# EAGLE design integrated_haptic (EAGLE 6.5.0)

## Sheet 1 of 6
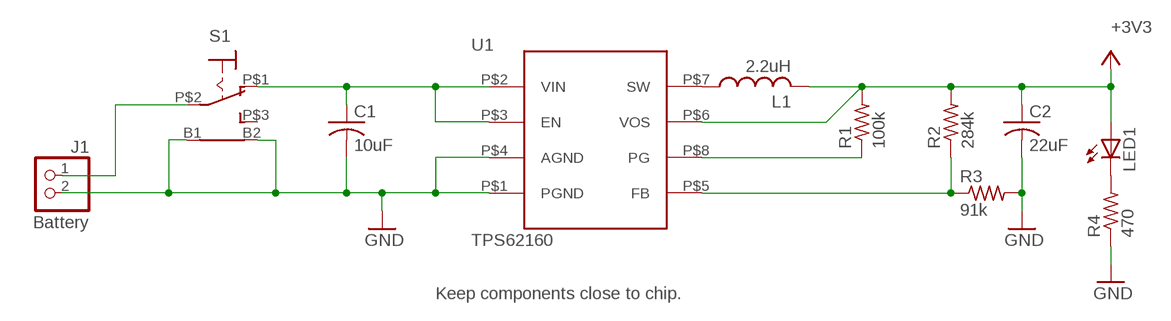
[diagram p0: schematic, sheet 1]

### Parts
C1  10uF  C-USC1206K  [C1206K]
C2  22uF  C-USC1206K  [C1206K]
J1  Battery  PINHD-1X2  [1X02]
L1  2.2uH  L-USL2520P  [L2520P]
LED1  LEDCHIP-LED0805  [CHIP-LED0805]
R1  100k  R-US_R0603  [R0603]
R2  284k  R-US_R0603  [R0603]
R3  91k  R-US_R0603  [R0603]
R4  470  R-US_R0603  [R0603]
S1  7101MD9AQE  [7101MD9A]
U1  TPS62160  [VSSOP]

### Nets
+3V3: C2.1 L1.2 LED1.A R1.2 R2.2 U1.P$6(VOS) ; also sheet 2,3,4,5
GND: C1.2 C2.2 J1.2 R3.2 R4.1 S1.B1(B) S1.B2(B1) U1.P$1(PGND) U1.P$4(AGND) ; also sheet 2,3,4,5,6
N$3: L1.1 U1.P$7(SW)
N$5: J1.1 S1.P$2(P)
N$17: LED1.C R4.2
N$32: R2.1 R3.1 U1.P$5(FB)
POWER_PG: R1.1 U1.P$8(PG)
VBAT: C1.1 S1.P$1(O) U1.P$2(VIN) U1.P$3(EN)
Unconnected: S1.P$3(S)

### Notes on the sheet
- Keep components close to chip.

## Sheet 2 of 6
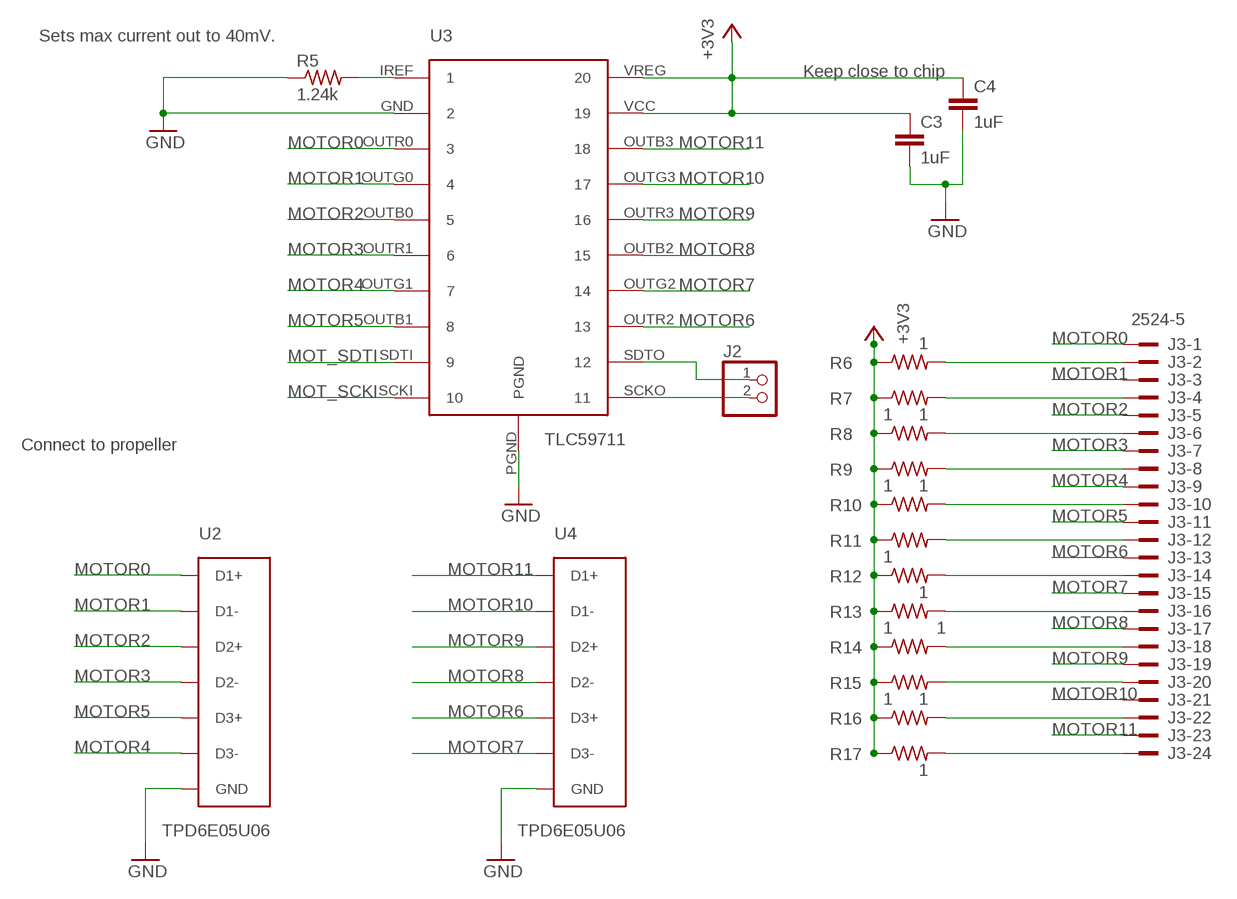
[diagram p1: schematic, sheet 2]

### Parts
C3  1uF  C-EUC0805K  [C0805K]
C4  1uF  C-EUC0805K  [C0805K]
J2  PINHD-1X2  [1X02]
J3  2524-5  [PAK100/2500-5-24]
R5  1.24k  R-US_R0603  [R0603]
R6  1  R-US_R0805  [R0805]
R7  1  R-US_R0805  [R0805]
R8  1  R-US_R0805  [R0805]
R9  1  R-US_R0805  [R0805]
R10  1  R-US_R0805  [R0805]
R11  1  R-US_R0805  [R0805]
R12  1  R-US_R0805  [R0805]
R13  1  R-US_R0805  [R0805]
R14  1  R-US_R0805  [R0805]
R15  1  R-US_R0805  [R0805]
R16  1  R-US_R0805  [R0805]
R17  1  R-US_R0805  [R0805]
U2  TPD6E05U06  [PUQFN-N14]
U3  TLC59711  [TLC59711]
U4  TPD6E05U06  [PUQFN-N14]

### Nets
+3V3: C3.1 C4.1 R6.1 R7.1 R8.1 R9.1 R10.1 R11.1 R12.1 R13.1 R14.1 R15.1 R16.1 R17.1 U3.VCC U3.VREG ; also sheet 1,3,4,5
GND: C3.2 C4.2 R5.1 U2.P$5(GND) U2.P$10(GND) U3.GND U3.PGND U4.P$5(GND) U4.P$10(GND) ; also sheet 1,3,4,5,6
MOT_SCKI: U3.SCKI ; also sheet 4,5
MOT_SDTI: U3.SDTI ; also sheet 4,5
MOTOR0: J3.1 U2.P$1(D1+) U2.P$14(D1+) U3.OUTR0
MOTOR1: J3.3 U2.P$2(D1-) U2.P$13(D1-) U3.OUTG0
MOTOR2: J3.5 U2.P$3(D2+) U2.P$12(D2+) U3.OUTB0
MOTOR3: J3.7 U2.P$4(D2-) U2.P$11(D2-) U3.OUTR1
MOTOR4: J3.9 U2.P$6(D3-) U2.P$9(D3-) U3.OUTG1
MOTOR5: J3.11 U2.P$7(D3+) U2.P$8(D3+) U3.OUTB1
MOTOR6: J3.13 U3.OUTR2 U4.P$7(D3+) U4.P$8(D3+)
MOTOR7: J3.15 U3.OUTG2 U4.P$6(D3-) U4.P$9(D3-)
MOTOR8: J3.17 U3.OUTB2 U4.P$4(D2-) U4.P$11(D2-)
MOTOR9: J3.19 U3.OUTR3 U4.P$3(D2+) U4.P$12(D2+)
MOTOR10: J3.21 U3.OUTG3 U4.P$2(D1-) U4.P$13(D1-)
MOTOR11: J3.23 U3.OUTB3 U4.P$1(D1+) U4.P$14(D1+)
N$1: R5.2 U3.IREF
N$4: J3.24 R17.2
N$6: J3.22 R16.2
N$7: J3.20 R15.2
N$8: J3.18 R14.2
N$9: J3.16 R13.2
N$10: J3.14 R12.2
N$11: J3.12 R11.2
N$12: J3.10 R10.2
N$13: J3.8 R9.2
N$14: J3.6 R8.2
N$15: J3.4 R7.2
N$16: J3.2 R6.2
N$18: J2.2 U3.SCKO
N$19: J2.1 U3.SDTO

### Notes on the sheet
- Sets max current out to 40mV.
- Keep close to chip
- Connect to propeller

## Sheet 3 of 6
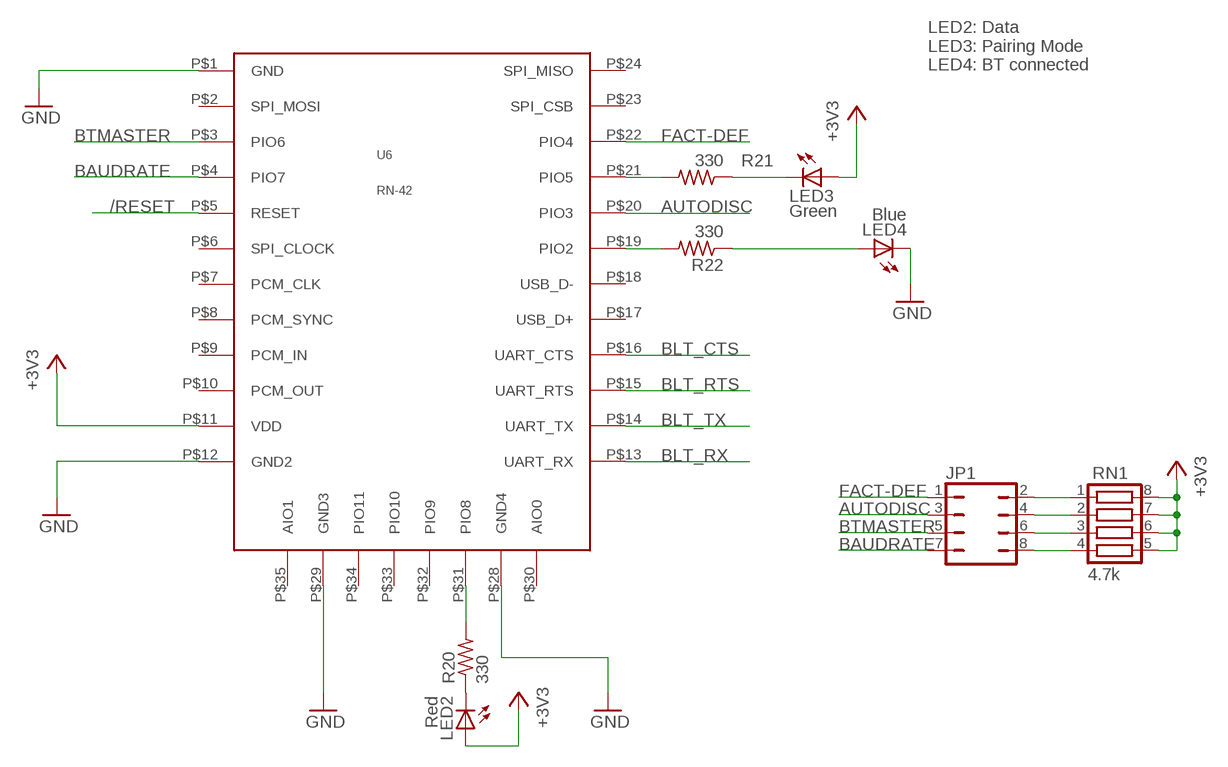
[diagram p2: schematic, sheet 3]

### Parts
JP1  JP4Q  [JP4Q]
LED2  Red  LEDCHIP-LED0805  [CHIP-LED0805]
LED3  Green  LEDCHIP-LED0805  [CHIP-LED0805]
LED4  Blue  LEDCHIP-LED0805  [CHIP-LED0805]
R20  330  R-US_R0603  [R0603]
R21  330  R-US_R0603  [R0603]
R22  330  R-US_R0603  [R0603]
RN1  4.7k  CTS742C083  [CTS742C083]
U6  RN-42  [RN-42]

### Nets
+3V3: LED2.A LED3.A RN1.5 RN1.6 RN1.7 RN1.8 U6.P$11(VDD) ; also sheet 1,2,4,5
/RESET: U6.P$5(RESET) ; also sheet 5,6
AUTODISC: JP1.3 U6.P$20(PIO3)
BAUDRATE: JP1.7 U6.P$4(PIO7)
BLT_CTS: U6.P$16(UART_CTS) ; also sheet 5
BLT_RTS: U6.P$15(UART_RTS) ; also sheet 5
BLT_RX: U6.P$13(UART_RX) ; also sheet 4,5
BLT_TX: U6.P$14(UART_TX) ; also sheet 4,5
BTMASTER: JP1.5 U6.P$3(PIO6)
FACT-DEF: JP1.1 U6.P$22(PIO4)
GND: LED4.C U6.P$1(GND) U6.P$12(GND2) U6.P$28(GND4) U6.P$29(GND3) ; also sheet 1,2,4,5,6
N$2: LED2.C R20.1
N$21: R21.2 U6.P$21(PIO5)
N$22: LED3.C R21.1
N$23: R22.2 U6.P$19(PIO2)
N$24: LED4.A R22.1
N$25: R20.2 U6.P$31(PIO8)
N$26: JP1.8 RN1.4
N$27: JP1.6 RN1.3
N$28: JP1.4 RN1.2
N$29: JP1.2 RN1.1
Unconnected: U6.P$2(SPI_MOSI) U6.P$6(SPI_CLOCK) U6.P$7(PCM_CLK) U6.P$8(PCM_SYNC) U6.P$9(PCM_IN) U6.P$10(PCM_OUT) U6.P$17(USB_D+) U6.P$18(USB_D-) U6.P$23(SPI_CSB) U6.P$24(SPI_MISO) U6.P$30(AIO0) U6.P$32(PIO9) U6.P$33(PIO10) U6.P$34(PIO11) U6.P$35(AIO1)

### Notes on the sheet
- LED2: Data
  LED3: Pairing Mode
  LED4: BT connected

## Sheet 4 of 6
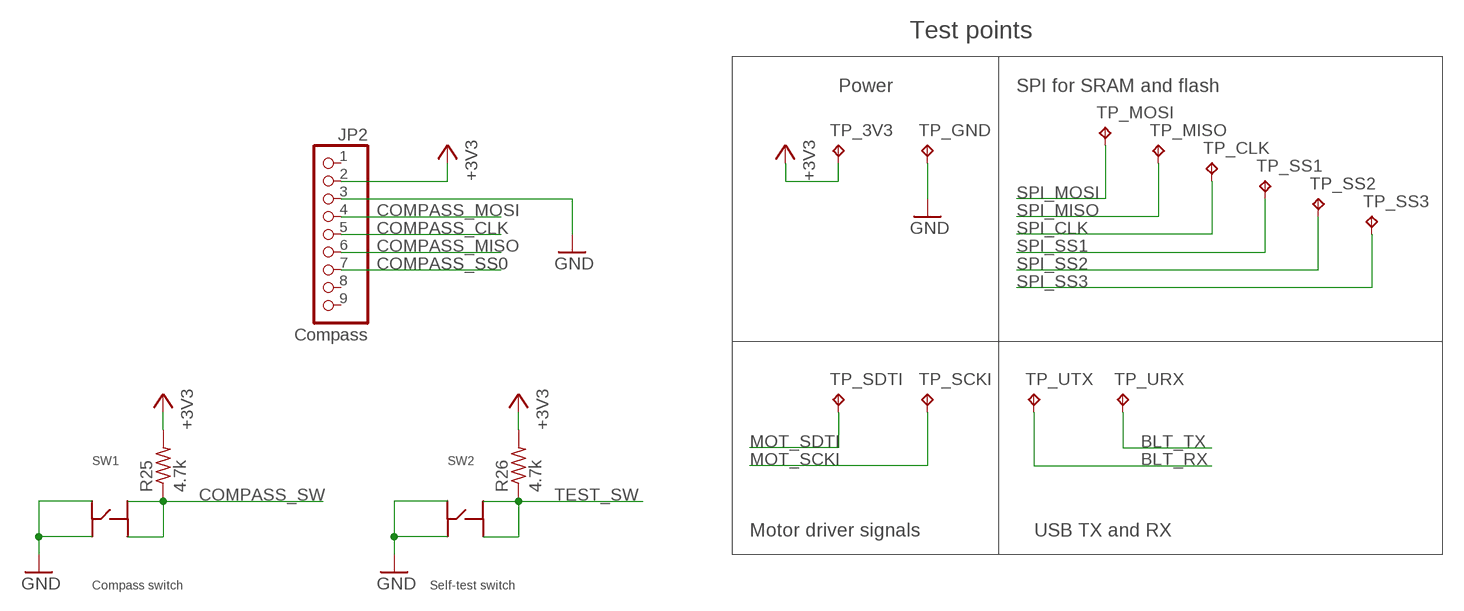
[diagram p3: schematic, sheet 4]

### Parts
JP2  Compass  PINHD-1X9  [1X09]
R25  4.7k  R-US_R0603  [R0603]
R26  4.7k  R-US_R0603  [R0603]
SW1  Compass switch  PUSHBUTTON  [6MMX6MM]
SW2  Self-test switch  PUSHBUTTON  [6MMX6MM]
TP_3V3  TPPAD1-13  [P1-13]
TP_CLK  TPPAD1-13  [P1-13]
TP_GND  TPPAD1-13  [P1-13]
TP_MISO  TPPAD1-13  [P1-13]
TP_MOSI  SPI_MOSI  TPPAD1-13  [P1-13]
TP_SCKI  TPPAD1-13  [P1-13]
TP_SDTI  TPPAD1-13  [P1-13]
TP_SS1  TPPAD1-13  [P1-13]
TP_SS2  TPPAD1-13  [P1-13]
TP_SS3  TPPAD1-13  [P1-13]
TP_URX  TPPAD1-13  [P1-13]
TP_UTX  TPPAD1-13  [P1-13]

### Nets
+3V3: JP2.2 R25.2 R26.2 TP_3V3.TP ; also sheet 1,2,3,5
BLT_RX: TP_UTX.TP ; also sheet 3,5
BLT_TX: TP_URX.TP ; also sheet 3,5
COMPASS_CLK: JP2.5 ; also sheet 5
COMPASS_MISO: JP2.6 ; also sheet 5
COMPASS_MOSI: JP2.4 ; also sheet 5
COMPASS_SS0: JP2.7 ; also sheet 5
COMPASS_SW: R25.1 SW1.P$2 SW1.P$4 ; also sheet 5
GND: JP2.3 SW1.P$1 SW1.P$3 SW2.P$1 SW2.P$3 TP_GND.TP ; also sheet 1,2,3,5,6
MOT_SCKI: TP_SCKI.TP ; also sheet 2,5
MOT_SDTI: TP_SDTI.TP ; also sheet 2,5
SPI_CLK: TP_CLK.TP ; also sheet 5
SPI_MISO: TP_MISO.TP ; also sheet 5
SPI_MOSI: TP_MOSI.TP ; also sheet 5
SPI_SS1: TP_SS1.TP ; also sheet 5
SPI_SS2: TP_SS2.TP ; also sheet 5
SPI_SS3: TP_SS3.TP ; also sheet 5
TEST_SW: R26.1 SW2.P$2 SW2.P$4 ; also sheet 5
Unconnected: JP2.1 JP2.8 JP2.9

### Notes on the sheet
- Test points
- Power | SPI for SRAM and flash
- Motor driver signals | USB TX and RX

## Sheet 5 of 6
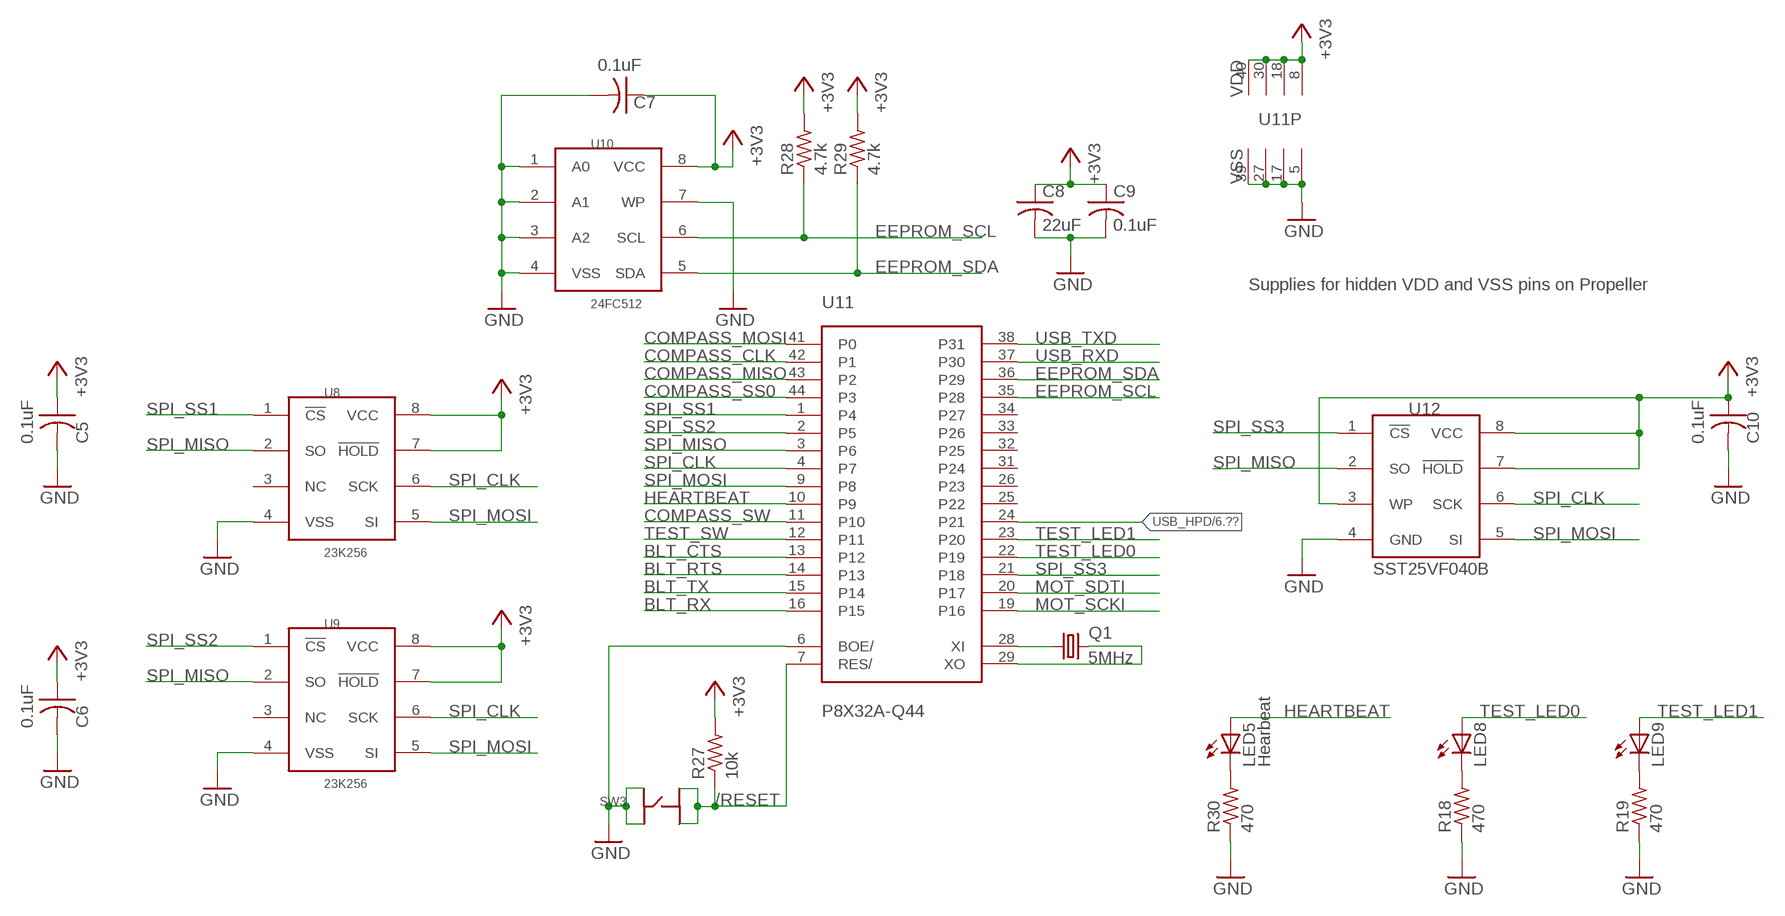
[diagram p4: schematic, sheet 5]

### Parts
C5  0.1uF  C-USC0805K  [C0805K]
C6  0.1uF  C-USC0805K  [C0805K]
C7  0.1uF  C-USC0805K  [C0805K]
C8  22uF  C-USC1206K  [C1206K]
C9  0.1uF  C-USC0805K  [C0805K]
C10  0.1uF  C-USC0805K  [C0805K]
LED5  Hearbeat  LEDCHIP-LED0805  [CHIP-LED0805]
LED8  LEDCHIP-LED0805  [CHIP-LED0805]
LED9  LEDCHIP-LED0805  [CHIP-LED0805]
Q1  5MHz  CRYSTALHC49UP  [HC49UP]
R18  470  R-US_R0603  [R0603]
R19  470  R-US_R0603  [R0603]
R27  10k  R-US_R0603  [R0603]
R28  4.7k  R-US_R0603  [R0603]
R29  4.7k  R-US_R0603  [R0603]
R30  470  R-US_R0603  [R0603]
SW3  PUSHBUTTON  [6MMX6MM]
U8  23K256  [SOIC8]
U9  23K256  [SOIC8]
U10  24FC512  [SOIC8]
U11  P8X32A-Q44  [P8X32A-Q44]
U12  SST25VF040B  [SOIC8]

### Nets
+3V3: C5.1 C6.1 C7.1 C8.1 C9.1 C10.1 R27.2 R28.2 R29.2 U8.7(!HOLD) U8.8(VCC) U9.7(!HOLD) U9.8(VCC) U10.8(VCC) U11.8(VDD) U11.18(VDD) U11.30(VDD) U11.40(VDD) U12.3(WP) U12.7(!HOLD) U12.8(VCC) ; also sheet 1,2,3,4
/RESET: R27.1 SW3.P$2 SW3.P$4 U11.7(RES/) ; also sheet 3,6
BLT_CTS: U11.13(P12) ; also sheet 3
BLT_RTS: U11.14(P13) ; also sheet 3
BLT_RX: U11.16(P15) ; also sheet 3,4
BLT_TX: U11.15(P14) ; also sheet 3,4
COMPASS_CLK: U11.42(P1) ; also sheet 4
COMPASS_MISO: U11.43(P2) ; also sheet 4
COMPASS_MOSI: U11.41(P0) ; also sheet 4
COMPASS_SS0: U11.44(P3) ; also sheet 4
COMPASS_SW: U11.11(P10) ; also sheet 4
EEPROM_SCL: R28.1 U10.6(SCL) U11.35(P28)
EEPROM_SDA: R29.1 U10.5(SDA) U11.36(P29)
GND: C5.2 C6.2 C7.2 C8.2 C9.2 C10.2 R18.1 R19.1 R30.1 SW3.P$1 SW3.P$3 U8.4(VSS) U9.4(VSS) U10.1(A0) U10.2(A1) U10.3(A2) U10.4(VSS) U10.7(WP) U11.5(VSS) U11.6(BOE/) U11.17(VSS) U11.27(VSS) U11.39(VSS) U12.4(GND) ; also sheet 1,2,3,4,6
HEARTBEAT: LED5.A U11.10(P9)
MOT_SCKI: U11.19(P16) ; also sheet 2,4
MOT_SDTI: U11.20(P17) ; also sheet 2,4
N$30: LED8.C R18.2
N$31: LED5.C R30.2
N$33: LED9.C R19.2
SPI_CLK: U8.6(SCK) U9.6(SCK) U11.4(P7) U12.6(SCK) ; also sheet 4
SPI_MISO: U8.2(SO) U9.2(SO) U11.3(P6) U12.2(SO) ; also sheet 4
SPI_MOSI: U8.5(SI) U9.5(SI) U11.9(P8) U12.5(SI) ; also sheet 4
SPI_SS1: U8.1(!CS) U11.1(P4) ; also sheet 4
SPI_SS2: U9.1(!CS) U11.2(P5) ; also sheet 4
SPI_SS3: U11.21(P18) U12.1(!CS) ; also sheet 4
TEST_LED0: LED8.A U11.22(P19)
TEST_LED1: LED9.A U11.23(P20)
TEST_SW: U11.12(P11) ; also sheet 4
USB_HPD: U11.24(P21) ; also sheet 6
USB_RXD: U11.37(P30) ; also sheet 6
USB_TXD: U11.38(P31) ; also sheet 6
XTAL0: Q1.2 U11.29(XO)
XTAL1: Q1.1 U11.28(XI)
Unconnected: U8.3(NC) U9.3(NC) U11.25(P22) U11.26(P23) U11.31(P24) U11.32(P25) U11.33(P26) U11.34(P27)

### Notes on the sheet
- Supplies for hidden VDD and VSS pins on Propeller

## Sheet 6 of 6
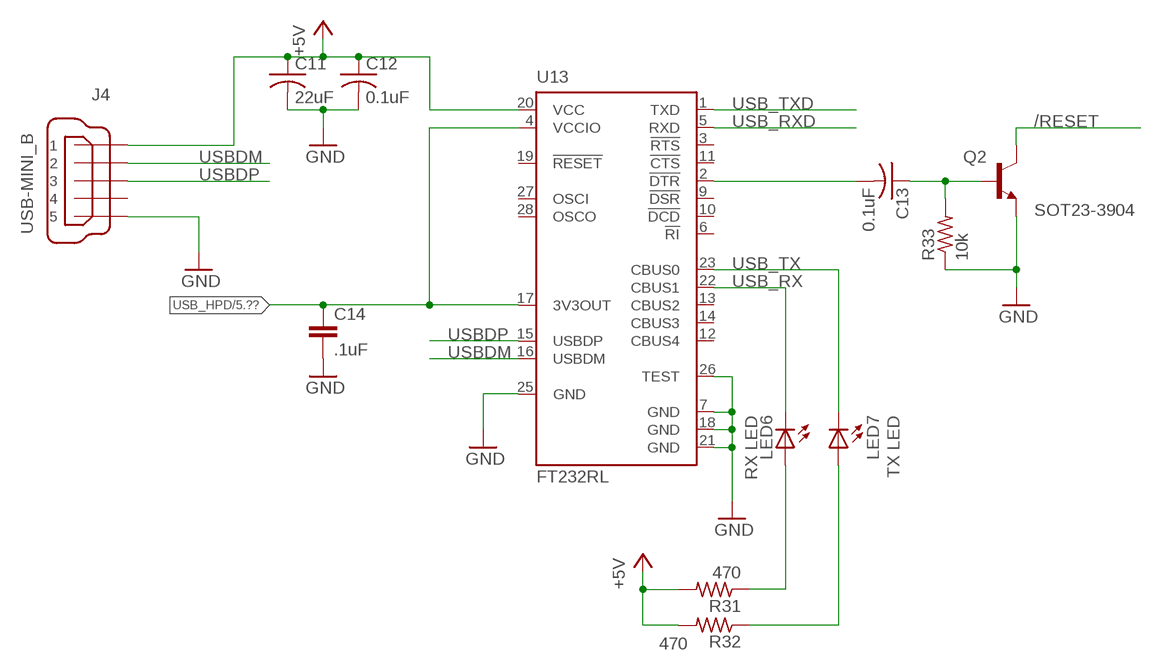
[diagram p5: schematic, sheet 6]

### Parts
C11  22uF  C-USC1206K  [C1206K]
C12  0.1uF  C-USC0805K  [C0805K]
C13  0.1uF  C-USC0805K  [C0805K]
C14  .1uF  C-EUC0805  [C0805]
J4  USB-MINI_B  [USB_MINI_B]
LED6  RX LED  LEDCHIP-LED0805  [CHIP-LED0805]
LED7  TX LED  LEDCHIP-LED0805  [CHIP-LED0805]
Q2  SOT23-3904  MMBT918LT1-NPN-SOT23-BEC  [SOT23-BEC]
R31  470  R-US_R0603  [R0603]
R32  470  R-US_R0603  [R0603]
R33  10k  R-US_R0603  [R0603]
U13  FT232RL  [SSOP28]

### Nets
+5V: C11.1 C12.1 J4.1 R31.2 R32.2 U13.20(VCC)
/RESET: Q2.C ; also sheet 3,5
GND: C11.2 C12.2 C14.2 J4.5 Q2.E R33.1 U13.7(GND) U13.18(GND) U13.21(GND) U13.25(GND) U13.26(TEST) ; also sheet 1,2,3,4,5
N$20: C13.2 U13.2(!DTR)
N$34: LED6.A R31.1
N$35: LED7.A R32.1
N$36: C13.1 Q2.B R33.2
USB_HPD: C14.1 U13.4(VCCIO) U13.17(3V3OUT) ; also sheet 5
USB_RX: LED6.C U13.22(CBUS1)
USB_RXD: U13.5(RXD) ; also sheet 5
USB_TX: LED7.C U13.23(CBUS0)
USB_TXD: U13.1(TXD) ; also sheet 5
USBDM: J4.2 U13.16(USBDM)
USBDP: J4.3 U13.15(USBDP)
Unconnected: J4.4 U13.3(!RTS) U13.6(!RI) U13.9(!DSR) U13.10(!DCD) U13.11(!CTS) U13.12(CBUS4) U13.13(CBUS2) U13.14(CBUS3) U13.19(!RESET) U13.27(OSCI) U13.28(OSCO)

## Library data of the parts
C1 C2 C5-C13 = resistor:C-US: CAPACITOR, American symbol
C3 C4 = resistor:C-EU: CAPACITOR, European symbol
C14 = rcl:C-EU: CAPACITOR, European symbol
J1 J2 = lkl_senior_design:PINHD-1X2: PIN HEADER
J3 = con-3m:2524-: 3M (TM) Pak 100 4-Wall Header Source: 3M; OC_FARNELL: 9838465; OC_NEWARK: unknown
J4 = lkl_senior_design:USB-MINI_B: MINI USB-B Conector Source: www.cypressindustries.com
JP1 = jumper:JP4Q: JUMPER
JP2 = pinhead:PINHD-1X9: PIN HEADER
L1 = lkl_senior_design:L-US: INDUCTOR, American symbol
LED1-LED9 = led:LED: LED OSRAM: - CHIPLED LG R971, LG N971, LY N971, LG Q971, LY Q971, LO R971, LY R971 LH N974, LH R974 LS Q976, LO Q976, LY Q976 LO Q996 - Hyper CHIPLED LW Q18S LB Q993, LB Q99A, LB R99A - SideLED LS A670, LO A670, LY A670, LG A670, LP A670 LB A673, LV A673, LT A673, LW A673 LH A674 LY A675 LS A676, LA A676, LO A676, LY A676, LW A676 LS A679, LY A679, LG A679 - Hyper Micro SIDELED® LS Y876, LA Y876, LO Y876, LY Y876 LT Y87S - SmartLED LW L88C, LW L88S LB L89C, LB L89S, LG L890 LS L89K, LO L89K, LY L89K LS L896, LA L896, LO L896, LY L896 - TOPLED LS T670, LO T670, LY T670, LG T670, LP T670 LSG T670, LSP T670, LSY T670, LOP T670, LYG T670 LG T671, LOG T671, LSG T671 LB T673, LV T673, LT T673, LW T673 LH T674 LS T676, LA T676, LO T676, LY T676, LB T676, LH T676, LSB T676, LW T676 LB T67C, LV T67C, LT T67C, LS T67K, LO T67K, LY T67K, LW E67C LS E67B, LA E67B, LO E67B, LY E67B, LB E67C, LV E67C, LT E67C LW T67C LS T679, LY T679, LG T679 LS T770, LO T770, LY T770, LG T770, LP T770 LB T773, LV T773, LT T773, LW T773 LH T774 LS E675, LA E675, LY E675, LS T675 LS T776, LA T776, LO T776, LY T776, LB T776 LHGB T686 LT T68C, LB T68C - Hyper Mini TOPLED® LB M676 - Mini TOPLED Santana® LG M470 LS M47K, LO M47K, LY M47K Source: http://www.osram.convergy.de LUXEON: - LUMILED® LXK2-PW12-R00, LXK2-PW12-S00, LXK2-PW14-U00, LXK2-PW14-V00 LXK2-PM12-R00, LXK2-PM12-S00, LXK2-PM14-U00 LXK2-PE12-Q00, LXK2-PE12-R00, LXK2-PE12-S00, LXK2-PE14-T00, LXK2-PE14-U00 LXK2-PB12-K00, LXK2-PB12-L00, LXK2-PB12-M00, LXK2-PB14-N00, LXK2-PB14-P00, LXK2-PB14-Q00 LXK2-PR12-L00, LXK2-PR12-M00, LXK2-PR14-Q00, LXK2-PR14-R00 LXK2-PD12-Q00, LXK2-PD12-R00, LXK2-PD12-S00 LXK2-PH12-R00, LXK2-PH12-S00 LXK2-PL12-P00, LXK2-PL12-Q00, LXK2-PL12-R00 Source: www.luxeon.com KINGBRIGHT: KA-3528ASYC Source: www.kingbright.com
Q1 = crystal:CRYSTAL: CRYSTAL; OC_FARNELL: unknown; OC_NEWARK: unknown
Q2 = transistor-neu-to92:*-NPN-: NPN Transistror
R1-R5 R18-R22 R25-R33 = rcl:R-US_: RESISTOR, American symbol
R6-R17 = resistor:R-US_: RESISTOR, American symbol
RN1 = lkl_senior_design:CTS742C083: Chip Resistor Array 4 Single Resistor Size: 1206; OC_FARNELL: unknown; OC_NEWARK: unknown
S1 = alex:7101: TOGGLE SWITCH
SW1-SW3 = lkl_senior_design:PUSHBUTTON
TP_3V3 TP_CLK TP_GND TP_MISO TP_MOSI TP_SCKI TP_SDTI TP_SS1-TP_SS3 TP_URX TP_UTX = testpad:TP: Test pad
U1 = lkl_senior_design:TPS62160
U2 U4 = alex:TPD6E05U06: TPD6E05U06 6-channel ESD Protection device supports up to 6Gbps interfaces. http://www.ti.com/lit/ds/symlink/tpd6e05u06.pdf
U3 = lkl_senior_design:TLC59711
U6 = lkl_senior_design:RN-42
U8 U9 = lkl_senior_design:23K256
U10 = lkl_senior_design:24FC512
U11 = parallax_propeller:P8X32A-Q44
U12 = lkl_senior_design:SST25VF040B
U13 = ftdichip:FT232R: Source: http://www.ftdichip.com/Documents/DataSheets/DS_FT232R_v104.pdf; MPN: FT232RL; OC_FARNELL: 1146032; OC_NEWARK: 91K9918

## Board
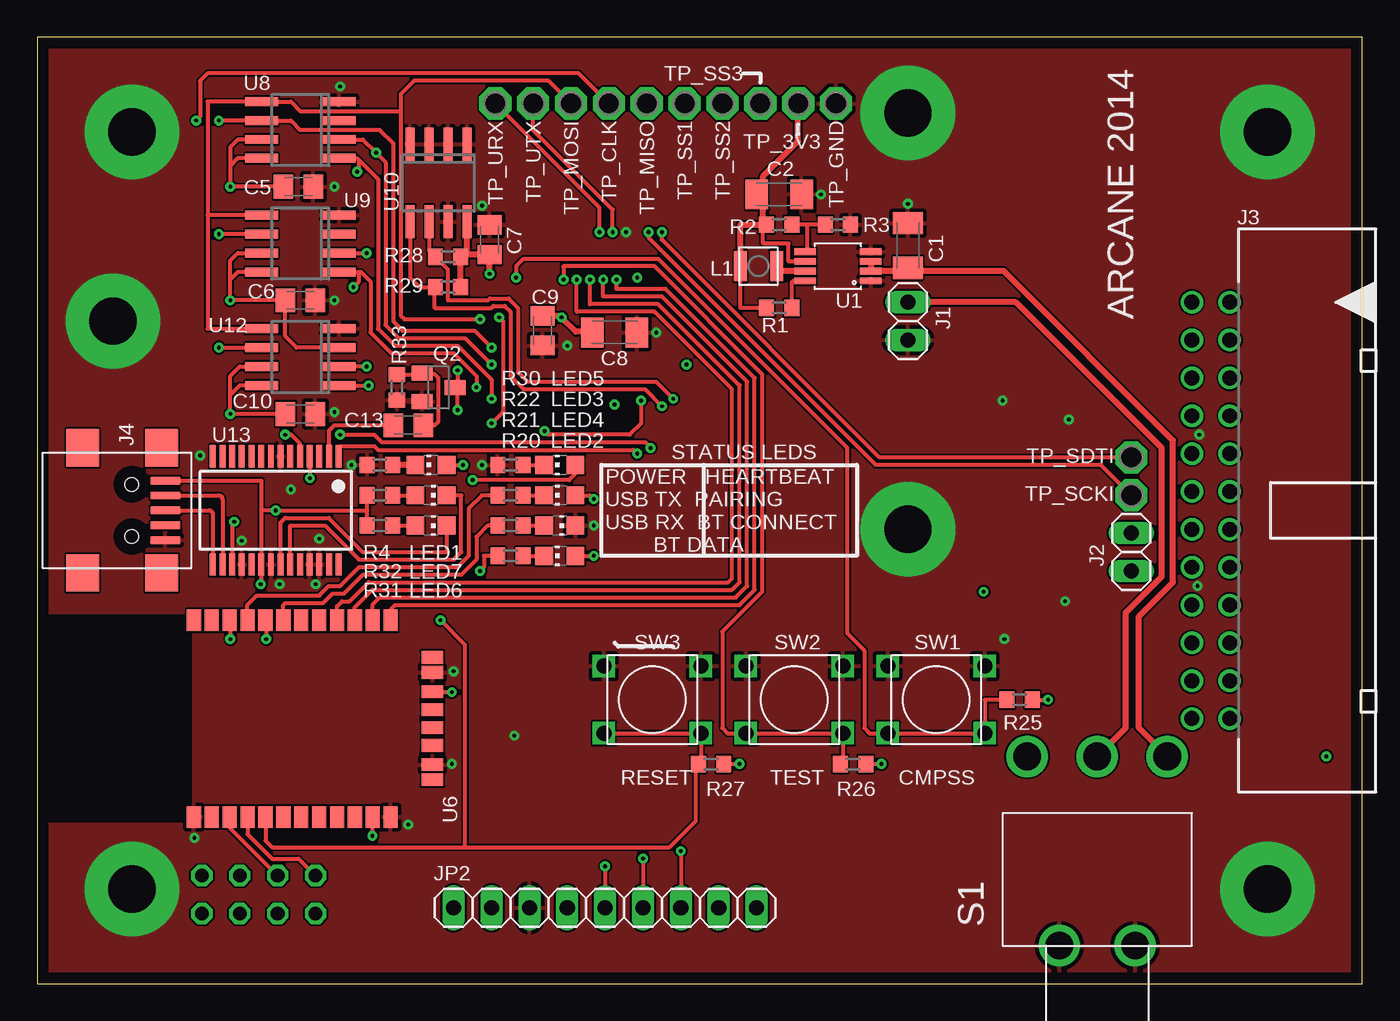
[diagram p6: board, top side]
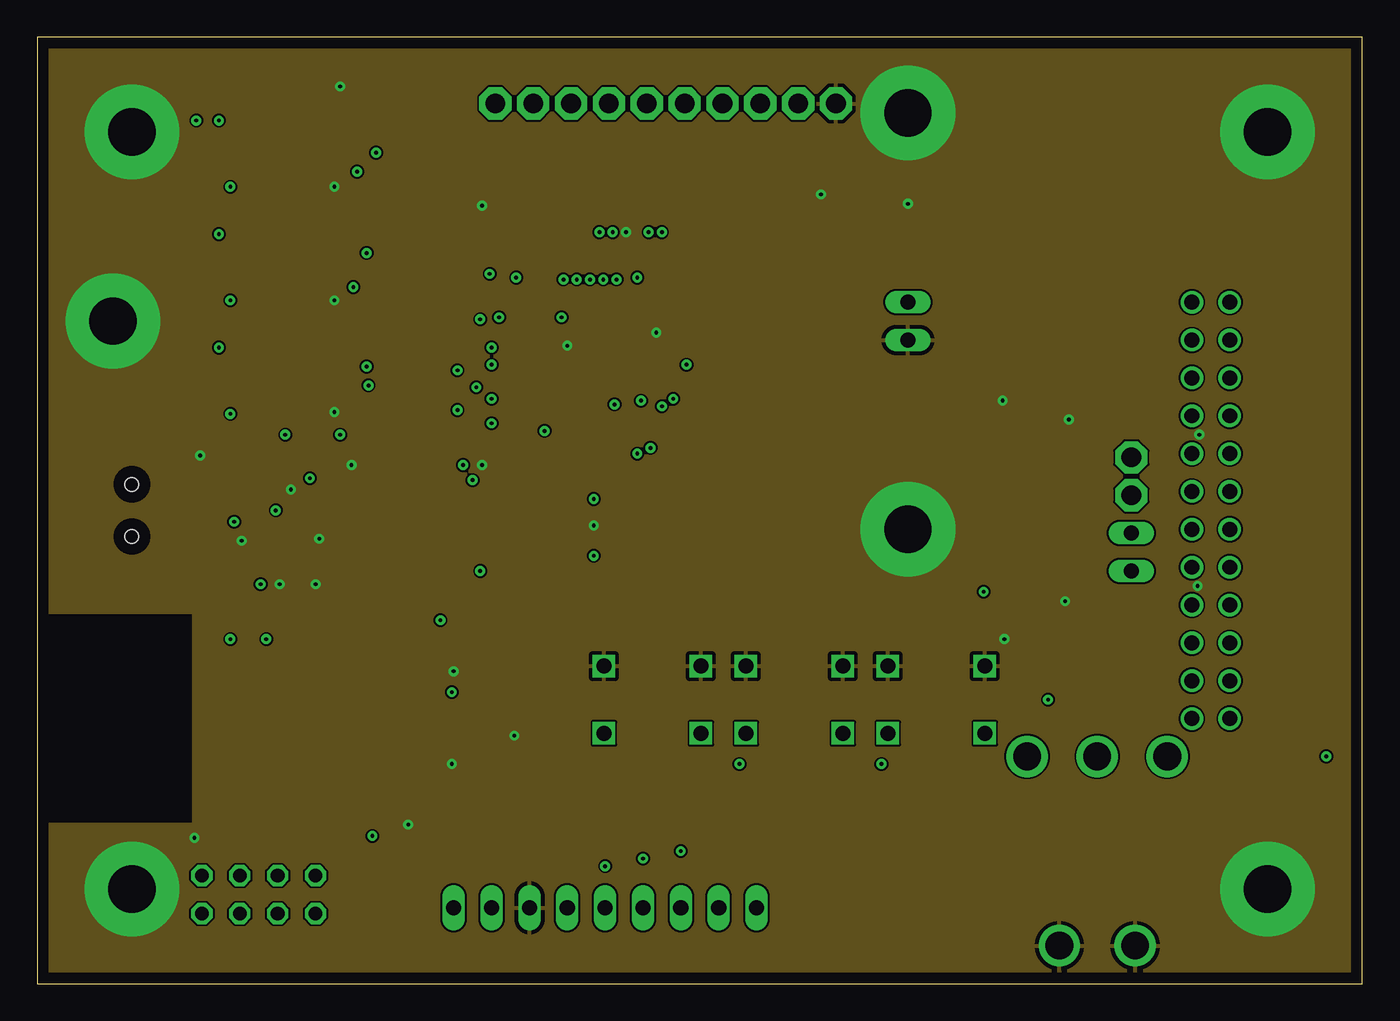
[diagram p7: board, inner layer Route2]
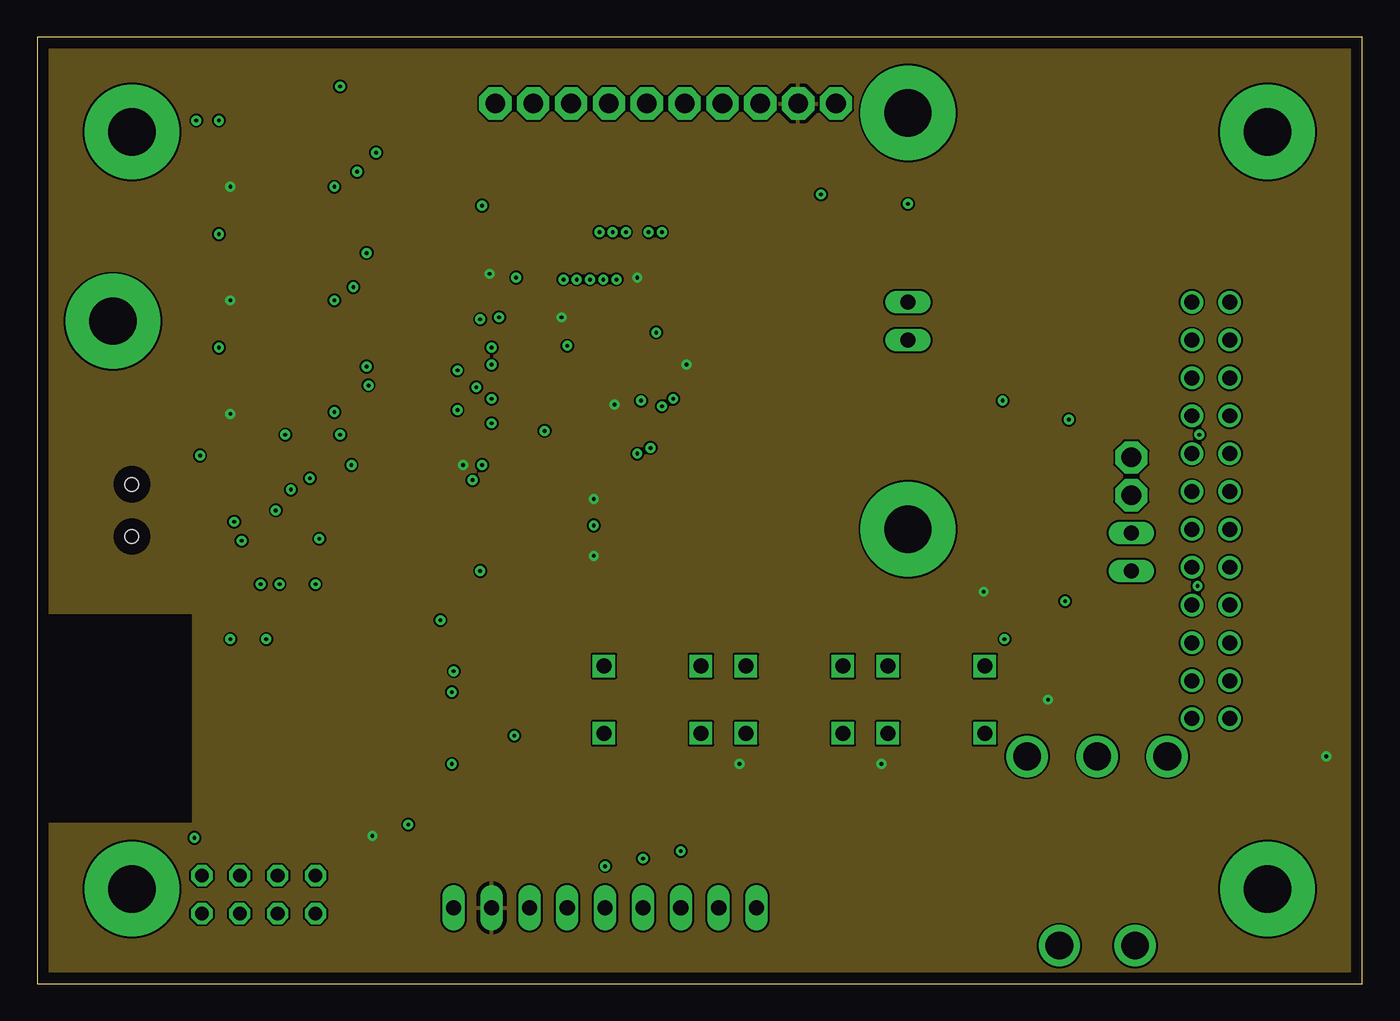
[diagram p8: board, inner layer Route15]
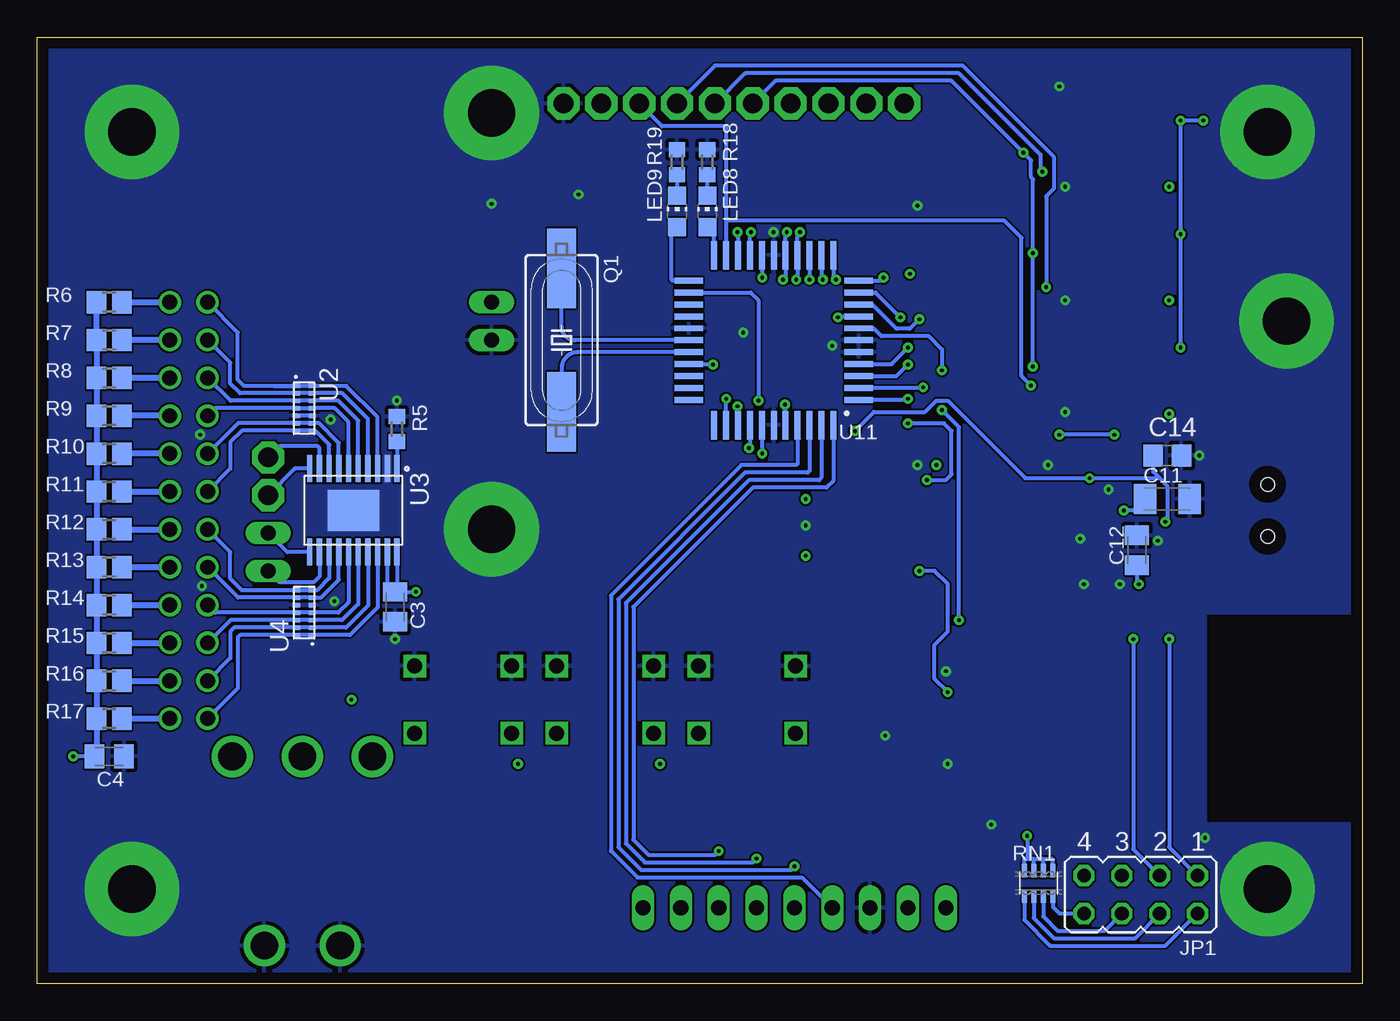
[diagram p9: board, bottom side, seen from below]

Size 88.9 x 63.5 mm. Coordinates in mm from the lower left corner, seen from the top.
Outline: 0,0 88.9,0 88.9,63.5 0,63.5 0,0
Copper layers (1+2*15+16): Top 0.035mm / dielectric 0.5mm / Route2 0.035mm / dielectric 0.43mm / Route15 0.035mm / dielectric 0.5mm / Bottom 0.035mm
Design rules "5-5 *": minimum track width 5mil, minimum drill 10mil, track to track 5mil, track to pad 5mil, pad to pad 5mil, via to via 5mil, smd to smd 0mil, copper to edge 30mil, drill to drill 8mil, minimum pad ring 10mil, minimum via ring 8mil, stop-mask expansion 4mil, vias tented up to drill 0mil, thermal gap 10mil

### Footprints (pad centres in the part's own frame; a part is rotated, then mirrored left to right if it is on the bottom)
C1206K = smd 1.5 x 2: 1 -1.5,0; 2 1.5,0
C0805K = smd 1.3 x 1.6: 1 -1,0; 2 1,0
C0805 = smd 1.3 x 1.5: 1 -0.95,0; 2 0.95,0
1X02 = drill 1.016 long: 1 -1.27,0; 2 1.27,0
PAK100/2500-5-24 = drill 1 pad 1.422: 1 -13.97,-1.27; 2 -13.97,1.27; 3 -11.43,-1.27; 4 -11.43,1.27; 5 -8.89,-1.27; 6 -8.89,1.27; 7 -6.35,-1.27; 8 -6.35,1.27; 9 -3.81,-1.27; 10 -3.81,1.27; 11 -1.27,-1.27; 12 -1.27,1.27; 13 1.27,-1.27; 14 1.27,1.27; 15 3.81,-1.27; 16 3.81,1.27; 17 6.35,-1.27; 18 6.35,1.27; 19 8.89,-1.27; 20 8.89,1.27; 21 11.43,-1.27; 22 11.43,1.27; 23 13.97,-1.27; 24 13.97,1.27
USB_MINI_B = smd 0.5 x 2: 1 -2,2.25; 2 -1,2.25; 3 0,2.25; 4 1,2.25; 5 2,2.25 | smd 2.5 x 2.2: P$6 -4.2,-3.3; P$7 4.2,-3.3; P$8 4.2,2; P$9 -4.2,2 | hole 0.9: -1.75,0; 1.75,0
JP4Q = drill 0.914 octagon: 1 -3.81,-1.27; 2 -3.81,1.27; 3 -1.27,-1.27; 4 -1.27,1.27; 5 1.27,-1.27; 6 1.27,1.27; 7 3.81,-1.27; 8 3.81,1.27
1X09 = drill 1.016 long: 1 -10.16,0; 2 -7.62,0; 3 -5.08,0; 4 -2.54,0; 5 0,0; 6 2.54,0; 7 5.08,0; 8 7.62,0; 9 10.16,0
L2520P = smd 0.85 x 2: 1 -1.225,0; 2 1.2,0
CHIP-LED0805 = smd 1.2 x 1.2: A 0,-1.05; C 0,1.05
HC49UP = smd 5.334 x 1.93: 1 -4.826,0; 2 4.826,0
SOT23-BEC = smd 1 x 1.4: B -0.95,-1.1; C 0,1.1; E 0.95,-1.1
R0603 = smd 1 x 1.1: 1 -0.85,0; 2 0.85,0
R0805 = smd 1.3 x 1.5: 1 -0.85,0; 2 0.85,0
CTS742C083 = smd 0.35 x 0.9: 1 -0.96,-0.85; 2 -0.32,-0.85; 3 0.32,-0.85; 4 0.96,-0.85; 5 0.96,0.85; 6 0.32,0.85; 7 -0.32,0.85; 8 -0.96,0.85
7101MD9A = drill 1.854: B1 -2.54,0; B2 2.54,0; P$1 4.699,12.7; P$2 0,12.7; P$3 -4.699,12.7
6MMX6MM = drill 1 square: P$1 3.25,2.25; P$2 3.25,-2.25; P$3 -3.25,2.25; P$4 -3.25,-2.25
P1-13 = drill 1.321 pad 2.159 octagon: TP 0,0
VSSOP = smd 0.45 x 1.45: P$1 -0.975,-2.2; P$2 -0.325,-2.2; P$3 0.325,-2.2; P$4 0.975,-2.2; P$5 0.975,2.2; P$6 0.325,2.2; P$7 -0.325,2.2; P$8 -0.975,2.2
PUQFN-N14 = smd 0.3 x 0.48: P$1 -1.5,-0.525; P$2 -1,-0.525; P$3 -0.5,-0.525; P$4 0,-0.525; P$5 0.5,-0.525; P$6 1,-0.525; P$7 1.5,-0.525; P$8 1.5,0.525; P$9 1,0.525; P$10 0.5,0.525; P$11 0,0.525; P$12 -0.5,0.525; P$13 -1,0.525; P$14 -1.5,0.525
TLC59711 = smd 0.35 x 1.8: GND -2.275,-2.8; IREF -2.925,-2.8; OUTB0 -0.325,-2.8; OUTB1 1.625,-2.8; OUTB2 0.325,2.8; OUTB3 -1.625,2.8; OUTG0 -0.975,-2.8; OUTG1 0.975,-2.8; OUTG2 0.975,2.8; OUTG3 -0.975,2.8; OUTR0 -1.625,-2.8; OUTR1 0.325,-2.8; OUTR2 1.625,2.8; OUTR3 -0.325,2.8; SCKI 2.925,-2.8; SCKO 2.925,2.8; SDTI 2.275,-2.8; SDTO 2.275,2.8; VCC -2.275,2.8; VREG -2.925,2.8 | smd 3.43 x 2.75: PGND 0,0
RN-42 = smd 1.45 x 0.95: P$1 -6.6,6; P$2 -6.6,4.8; P$3 -6.6,3.6; P$4 -6.6,2.4; P$5 -6.6,1.2; P$6 -6.6,0; P$7 -6.6,-1.2; P$8 -6.6,-2.4; P$9 -6.6,-3.6; P$10 -6.6,-4.8; P$11 -6.6,-6; P$12 -6.6,-7.2; P$13 6.6,-7.2; P$14 6.6,-6; P$15 6.6,-4.8; P$16 6.6,-3.6; P$17 6.6,-2.4; P$18 6.6,-1.2; P$19 6.6,0; P$20 6.6,1.2; P$21 6.6,2.4; P$22 6.6,3.6; P$23 6.6,4.8; P$24 6.6,6 | smd 0.85 x 1.45: P$28 3.1,-10; P$29 -3.1,-10; P$30 4.1,-10; P$31 1.8,-10; P$32 0.6,-10; P$33 -0.6,-10; P$34 -1.8,-10; P$35 -4.1,-10
SOIC8 = smd 0.6 x 2.2: 1 -1.905,-2.6; 2 -0.635,-2.6; 3 0.635,-2.6; 4 1.905,-2.6; 5 1.905,2.6; 6 0.635,2.6; 7 -0.635,2.6; 8 -1.905,2.6
P8X32A-Q44 = smd 1.9 x 0.4: 1 -5.713,4.013; 2 -5.713,3.212; 3 -5.713,2.413; 4 -5.713,1.613; 5 -5.713,0.812; 6 -5.713,0.013; 7 -5.713,-0.787; 8 -5.713,-1.587; 9 -5.713,-2.388; 10 -5.713,-3.188; 11 -5.713,-3.987; 23 5.688,-3.987; 24 5.688,-3.188; 25 5.688,-2.388; 26 5.688,-1.587; 27 5.688,-0.787; 28 5.688,0.013; 29 5.688,0.812; 30 5.688,1.613; 31 5.688,2.413; 32 5.688,3.212; 33 5.688,4.013 | smd 0.4 x 1.9: 12 -4.013,-5.688; 13 -3.212,-5.688; 14 -2.413,-5.688; 15 -1.613,-5.688; 16 -0.812,-5.688; 17 -0.013,-5.688; 18 0.787,-5.688; 19 1.587,-5.688; 20 2.388,-5.688; 21 3.188,-5.688; 22 3.987,-5.688; 34 3.987,5.713; 35 3.188,5.713; 36 2.388,5.713; 37 1.587,5.713; 38 0.787,5.713; 39 -0.013,5.713; 40 -0.812,5.713; 41 -1.613,5.713; 42 -2.413,5.713; 43 -3.212,5.713; 44 -4.013,5.713
SSOP28 = smd 0.4 x 1.5: 1 -4.225,-3.625; 2 -3.575,-3.625; 3 -2.925,-3.625; 4 -2.275,-3.625; 5 -1.625,-3.625; 6 -0.975,-3.625; 7 -0.325,-3.625; 8 0.325,-3.625; 9 0.975,-3.625; 10 1.625,-3.625; 11 2.275,-3.625; 12 2.925,-3.625; 13 3.575,-3.625; 14 4.225,-3.625; 15 4.225,3.625; 16 3.575,3.625; 17 2.925,3.625; 18 2.275,3.625; 19 1.625,3.625; 20 0.975,3.625; 21 0.325,3.625; 22 -0.325,3.625; 23 -0.975,3.625; 24 -1.625,3.625; 25 -2.275,3.625; 26 -2.925,3.625; 27 -3.575,3.625; 28 -4.225,3.625

### Placement (x,y rotation side)
C1  58.42,49.53 90 top
C2  49.78,52.96 0 top
C3  64.9,25.27 270 bottom
C4  84.07,15.24 0 bottom
C5  17.53,53.47 0 top
C6  17.65,45.85 0 top
C7  30.35,49.91 90 top
C8  38.73,43.69 0 top
C9  33.91,43.81 270 top
C10  17.65,38.23 0 top
C11  13.08,32.51 0 bottom
C12  15.11,29.08 90 bottom
C13  24.89,37.47 180 top
C14  13.08,35.43 0 bottom
J1  58.42,44.45 270 top
J2  73.41,28.96 90 top
J3  78.74,31.75 270 top
J4  6.35,31.75 270 top
JP1  14.86,5.97 180 bottom
JP2  38.1,5.08 0 top
L1  48.39,48.13 180 top
LED1  26.42,34.8 90 top
LED2  35.05,28.7 90 top
LED3  35.05,32.77 90 top
LED4  35.05,30.73 270 top
LED5  35.05,34.8 90 top
LED6  26.42,30.73 270 top
LED7  26.42,32.77 270 top
LED8  43.94,51.82 0 bottom
LED9  45.97,51.82 0 bottom
Q1  53.72,43.18 270 bottom
Q2  26.92,40.01 270 top
R1  49.78,45.34 180 top
R2  49.78,50.93 180 top
R3  53.72,50.93 0 top
R4  22.99,34.8 0 top
R5  64.77,37.21 270 bottom
R6  84.07,45.72 0 bottom
R7  84.07,43.18 0 bottom
R8  84.07,40.64 0 bottom
R9  84.07,38.1 0 bottom
R10  84.07,35.56 0 bottom
R11  84.07,33.02 0 bottom
R12  84.07,30.48 0 bottom
R13  84.07,27.94 0 bottom
R14  84.07,25.4 0 bottom
R15  84.07,22.86 0 bottom
R16  84.07,20.32 0 bottom
R17  84.07,17.78 0 bottom
R18  43.94,55.12 270 bottom
R19  45.97,55.12 270 bottom
R20  31.75,28.7 180 top
R21  31.75,32.77 180 top
R22  31.75,30.73 180 top
R25  65.91,19.05 0 top
R26  54.74,14.73 0 top
R27  45.21,14.73 0 top
R28  27.56,48.77 0 top
R29  27.56,46.74 0 top
R30  31.75,34.8 0 top
R31  22.99,30.73 180 top
R32  22.99,32.77 180 top
R33  24.13,40.01 90 top
RN1  21.72,6.73 0 bottom
S1  71.12,2.54 0 top
SW1  60.33,19.05 0 top
SW2  50.8,19.05 0 top
SW3  41.27,19.05 0 top
TP_3V3  51.05,59.05 270 top
TP_CLK  38.35,59.05 90 top
TP_GND  53.59,59.05 270 top
TP_MISO  40.89,59.05 90 top
TP_MOSI  35.81,59.05 90 top
TP_SCKI  73.41,32.77 0 top
TP_SDTI  73.41,35.31 0 top
TP_SS1  43.43,59.05 90 top
TP_SS2  45.97,59.05 90 top
TP_SS3  48.51,59.05 90 top
TP_URX  30.73,59.05 180 top
TP_UTX  33.27,59.05 180 top
U1  53.72,48.13 90 top
U2  70.99,38.61 270 bottom
U3  67.69,31.75 180 bottom
U4  70.99,24.89 90 bottom
U6  16.51,17.78 90 top
U8  17.65,57.28 90 top
U9  17.65,49.66 90 top
U10  26.92,53.72 180 top
U11  39.5,43.18 180 bottom
U12  17.65,42.04 90 top
U13  16,31.75 180 top

### Tracks (layer width: path | path; a pad name or v marks a point on that pad's centre or on a via)
+3V3  (via drill 0.25)
  Top 0.254: R1.2 47.19,45.34 L1.2 | U1.P$6 50.42,48.46 50.42,49.66 48.71,49.66 48.71,50.7 R2.2 | U6.P$11 22.51,10.7 22.48,10.67 v22.48,9.91 | 12.95,54.86 v12.95,53.47 C5.1 | 12.95,39.5 v12.95,38.23 C10.1 16.64,38.21 16.64,37.97 | 12.95,39.5 12.95,40.77 13.59,41.4 U12.7 | U12.8 13.59,40.13 12.95,39.5 | 12.95,47.24 v12.95,45.85 C6.1 16.64,45.83 16.64,43.43 17.4,42.67 U12.3 | 12.95,47.24 12.95,48.51 13.46,49.02 U9.7 | U9.8 13.46,47.75 12.95,47.24 | U8.8 13.46,55.37 12.95,54.86 | U8.7 13.46,56.64 12.95,56.13 12.95,54.86 | 36.07,32.77 LED3.A 37.08,32.77 v37.34,32.51 | R27.2 v47.12,14.73 | LED2.A v37.34,28.7 | R26.2 v56.64,14.73 | LED1.A v28.57,34.8 | R25.2 v67.82,19.05
  Top 0.406: L1.2 47.19,50.93 R2.2 48.71,51.15 48.71,52.54 | C9.1 35.07,44.81 v35.18,44.7 36.14,43.74 37.18,43.74 C8.1 | 48.71,52.54 C2.1 | 48.71,52.54 48.71,54.16 51.05,56.51 TP_3V3.TP | 28.83,48.91 C7.1 v30.35,47.62 | 28.83,48.91 U10.8 | 28.83,48.91 28.41,48.91 R28.2 R29.2
  Route15 0.254: v63.5,26.29 63.37,26.29
  Bottom 0.254: RN1.5 20.76,8.31 20.83,8.38 21.46,8.38 | RN1.8 22.68,8.31 22.61,8.38 22.48,8.38 | 22.48,8.38 22.1,8.38 | 22.1,8.38 21.46,8.38 | RN1.7 22.04,8.32 22.1,8.38 | RN1.6 21.4,8.32 21.46,8.38 | v22.48,9.91 22.48,8.38 | U11.30 43.6,41.57 v43.56,41.53 | U11.8 35.12,44.77 v35.18,44.7 | U11.18 40.28,47.4 v40.26,47.37 | U11.40 38.68,38.81 v38.73,38.86 | U3.VREG 64.77,26.4 C3.1 | U3.VCC 65.42,26.79 C3.1 | C3.1 64.53,26.27 64.52,26.29 v63.5,26.29 | C4.1 v86.49,15.24
  Bottom 0.406: C4.1 84.92,15.39 R17.1 R16.1 R15.1 R14.1 R13.1 R12.1 R11.1 R10.1 R9.1 R8.1 R7.1 R6.1
  pour Route15: 0,63.5 88.9,63.5 88.9,0 0,0 0,10.67 10.54,10.67 10.54,24.89 0,24.89
+5V  (via drill 0.25)
  Top 0.254: J4.1 15.03,33.75 15.03,31.75 | 15.03,31.75 U13.20 15.03,26.84 v14.99,26.8 | 15.03,31.75 v16,31.75 22.14,31.75 | 22.14,31.75 R32.2 | R31.2 22.14,31.75
  Bottom 0.254: C11.1 15.03,32.51 15.03,31.75 v16,31.75 | C12.1 15.11,26.92 v14.99,26.8
/RESET  (via drill 0.25)
  Top 0.254: 28.7,9.14 28.7,22.73 v27.05,24.38 | SW3.P$4 SW3.P$2 44.52,15.06 44.2,14.73 R27.1 44.2,14.57 44.2,10.92 42.42,9.14 28.7,9.14 | v28.19,38.48 28.19,39.84 | 28.19,39.84 Q2.C | U6.P$5 15.31,9.58 15.75,9.14 28.7,9.14 | v28.19,41.15 28.19,39.84
  Bottom 0.254: v27.05,24.38 27.05,37.34 v28.19,38.48 | U11.7 33.76,43.94 32.77,43.94 32.26,43.43 29.08,43.43 28.19,42.55 v28.19,41.15
AUTODISC  (via drill 0.25)
  Top 0.254: U6.P$20 15.31,24.84 15.37,24.89 v15.37,23.11
  Bottom 0.254: v15.37,23.11 15.37,9.02 JP1.3
BAUDRATE
  Top 0.254: U6.P$4 14.11,10.02 15.75,8.38 17.53,8.38 JP1.7
BLT_CTS  (via drill 0.25)
  Top 0.254: U6.P$16 20.11,25.32 20.45,25.65 20.95,25.65 22.23,26.92 46.35,26.92 46.61,27.18 46.61,39.88 41.4,45.09 36.2,45.09 v36.2,47.24
  Bottom 0.254: U11.13 36.28,47.33 v36.2,47.24
BLT_RTS  (via drill 0.25)
  Top 0.254: U6.P$15 21.31,25.25 22.48,26.42 46.61,26.42 47.12,26.92 47.12,40.13 41.66,45.59 37.08,45.59 v37.08,47.24
  Bottom 0.254: U11.14 v37.08,47.24
BLT_RX  (via drill 0.25)
  Top 0.254: U6.P$13 23.75,24.42 23.75,25.15 24,25.4 47.12,25.4 48.13,26.42 48.13,40.64 42.16,46.61 38.86,46.61 v38.86,47.24 | v38.61,50.42 38.61,51.94 33.27,57.28 TP_UTX.TP
  Bottom 0.254: v38.86,47.24 38.68,47.42 U11.16 38.68,50.34 v38.61,50.42
BLT_TX  (via drill 0.25)
  Top 0.254: U6.P$14 22.51,25.43 22.99,25.91 46.86,25.91 47.62,26.67 47.62,40.39 41.91,46.1 37.97,46.1 v37.97,47.24 | v37.72,50.42 37.72,52.07 TP_URX.TP
  Bottom 0.254: v37.97,47.24 37.88,47.33 U11.15 37.88,50.25 v37.72,50.42
BTMASTER
  Top 0.254: U6.P$3 12.91,10.46 JP1.5
COMPASS_CLK  (via drill 0.25)
  Top 0.254: v38.1,7.87 JP2.5
  Bottom 0.254: U11.42 37.08,34.42 37.21,34.29 41.4,34.29 49.91,25.78 49.91,9.14 48.39,7.62 38.35,7.62 v38.1,7.87
COMPASS_MISO  (via drill 0.25)
  Top 0.254: v40.64,8.38 JP2.6
  Bottom 0.254: U11.43 36.28,33.95 36.45,33.78 41.15,33.78 49.4,25.53 49.4,9.4 48.13,8.13 40.89,8.13 v40.64,8.38
COMPASS_MOSI
  Bottom 0.254: U11.41 37.88,34.89 37.97,34.8 41.66,34.8 50.42,26.04 50.42,8.89 48.64,7.11 37.59,7.11 JP2.4
COMPASS_SS0  (via drill 0.25)
  Top 0.254: v43.18,8.89 JP2.7
  Bottom 0.254: U11.44 35.48,33.73 35.94,33.27 40.89,33.27 48.9,25.27 48.9,9.65 47.88,8.64 43.43,8.64 v43.18,8.89
COMPASS_SW  (via drill 0.25)
  Top 0.254: v32.13,47.37 32.13,48.13 32.64,48.64 41.66,48.64 54.36,35.94 54.36,23.5 55.5,22.35 55.5,17.14 55.84,16.8 SW1.P$4 SW1.P$2 63.58,19.05 R25.1
  Bottom 0.254: U11.11 32.33,47.17 v32.13,47.37
EEPROM_SCL  (via drill 0.25)
  Top 0.254: U10.6 26.29,49.19 R28.1 | R28.1 26.71,48.73 | v42.67,39.24 41.53,40.39 32.89,40.39 32.26,41.02 32.26,45.34 31.62,45.97 30.35,45.97 30.23,45.85 27.56,45.85 27.56,47.92 R28.1
  Bottom 0.254: U11.35 42.68,39.23 v42.67,39.24
EEPROM_SDA  (via drill 0.25)
  Top 0.254: U10.5 25.02,47.37 25.65,46.74 R29.1 | R29.1 26.71,46.7 | v41.91,38.73 40.77,39.88 32.64,39.88 31.75,40.77 31.75,45.09 31.37,45.47 30.61,45.47 30.48,45.34 26.67,45.34 26.67,46.7 R29.1
  Bottom 0.254: U11.36 41.88,38.71 v41.91,38.73
FACT-DEF  (via drill 0.25)
  Top 0.254: U6.P$22 12.91,24.85 12.95,24.89 v12.95,23.11
  Bottom 0.254: v12.95,23.11 12.95,9.14 JP1.1
GND  (via drill 0.25, 3.17 pad 6.35)
  Bottom 0.254: U2.P$10 U2.P$5
  other vias: 6.35,57.15 5.08,44.45 6.35,6.35 58.42,30.48 82.55,6.35 82.55,57.15 58.42,58.42 17.02,33.15 18.67,26.8 16.26,26.8 18.92,29.84 27.81,14.73 27.94,20.95 32,16.64 24.89,10.67 10.54,9.78 19.94,45.85 19.94,53.47 19.94,38.35 29.84,34.8 37.34,30.73 29.84,52.2 20.32,60.2 21.08,34.8 13.72,29.72 77.98,36.83 64.77,39.12 64.9,23.11 77.85,26.67 68.96,25.65 69.22,37.85 41.53,43.69 39.5,50.42 52.58,52.96 58.42,52.32 35.56,42.8 10.92,35.43
  pour Top: 0,63.5 88.9,63.5 88.9,0 0,0 0,10.67 10.54,10.67 10.54,24.89 0,24.89
  pour Bottom (no thermals): 70.99,35.69 64.39,35.69 64.39,27.81 70.99,27.81
  pour Bottom: 0,63.5 88.9,63.5 88.9,0 0,0 0,10.67 10.54,10.67 10.54,24.89 0,24.89
  pour Route2: 0,63.5 88.9,63.5 88.9,0 0,0 0,10.67 10.54,10.67 10.54,24.89 0,24.89
HEARTBEAT  (via drill 0.25)
  Top 0.254: v30.99,44.7 31.24,44.45 31.24,38.35 v30.48,37.59 | LED5.A 36.23,34.92 36.23,34.32 35.69,33.78 v29.21,33.78
  Bottom 0.254: U11.10 32.65,46.37 v30.99,44.7 | v29.21,33.78 27.94,33.78 27.56,34.16 27.56,37.08 28.07,37.59 v30.48,37.59
MOT_SCKI  (via drill 0.25)
  Top 0.254: TP_SCKI.TP 71.37,34.8 56.26,34.8 41.02,50.04 v41.02,50.42
  Bottom 0.254: U3.SCKI 71.62,34.55 TP_SCKI.TP | U11.19 41.08,50.35 v41.02,50.42
MOT_SDTI  (via drill 0.25)
  Top 0.254: TP_SDTI.TP 56.52,35.31 41.91,49.91 v41.91,50.42
  Bottom 0.254: U3.SDTI 69.97,35.93 70.1,36.07 72.64,36.07 TP_SDTI.TP | v41.91,50.42 41.88,50.39 U11.20
MOTOR0
  Bottom 0.254: U3.OUTR0 66.07,38 68.17,40.11 U2.P$14 U2.P$1 | J3.1 75.44,43.69 75.44,40.51 75.03,40.11 U2.P$1 | 73.03,40.11 U2.P$1
MOTOR1
  Bottom 0.254: U3.OUTG0 66.72,37.89 68.44,39.61 U2.P$13 U2.P$2 75.3,39.61 75.95,40.26 75.95,41.66 J3.3
MOTOR2
  Bottom 0.254: U3.OUTB0 67.37,37.77 68.7,39.11 U2.P$12 U2.P$3 75.94,39.11 J3.5
MOTOR3
  Bottom 0.254: U3.OUTR1 68.02,37.66 68.96,38.61 U2.P$11 U2.P$4 76.96,38.61 J3.7
MOTOR4
  Bottom 0.254: U3.OUTG1 68.67,36.28 69.99,37.61 U2.P$9 U2.P$6 75.42,37.61 J3.9
MOTOR5
  Bottom 0.254: U3.OUTB1 69.32,36.17 70.25,37.11 U2.P$8 U2.P$7 75.16,37.11 75.95,36.32 75.95,34.54 J3.11
MOTOR6
  Bottom 0.254: U3.OUTR2 69.32,27.2 70.13,26.39 U4.P$7 U4.P$8 75.16,26.39 75.95,27.18 75.95,28.96 J3.13
MOTOR7
  Bottom 0.254: J3.15 75.42,25.89 U4.P$9 U4.P$6 69.87,25.89 68.67,27.09 U3.OUTG2
MOTOR8
  Bottom 0.254: U3.OUTB2 68.02,25.58 68.71,24.89 U4.P$4 U4.P$11 76.96,24.89 J3.17
MOTOR9
  Bottom 0.254: U3.OUTR3 67.37,25.47 68.44,24.39 U4.P$3 U4.P$12 75.94,24.39 J3.19
MOTOR10
  Bottom 0.254: U3.OUTG3 66.72,25.36 68.18,23.89 U4.P$2 U4.P$13 75.68,23.89 75.95,23.62 75.95,21.84 J3.21
MOTOR11
  Bottom 0.254: U3.OUTB3 66.04,28.92 66.04,25.27 67.92,23.39 U4.P$1 U4.P$14 75.29,23.39 75.44,23.24 75.44,19.81 J3.23
N$1
  Bottom 0.254: R5.2 U3.IREF arc-90 U3.IREF
N$2
  Top 0.254: R20.1 LED2.C
N$3
  Top 0.406: U1.P$7 49.94,47.81 L1.1
N$4
  Bottom 0.406: R17.2 J3.24
N$5
  Top 0.406: J1.1 65.66,45.72 75.44,35.94 75.44,27.3 73.03,24.89 73.03,17.14 S1.P$2
N$6
  Bottom 0.406: R16.2 J3.22
N$7
  Bottom 0.406: R15.2 J3.20
N$8
  Bottom 0.406: R14.2 J3.18
N$9
  Bottom 0.406: R13.2 J3.16
N$10
  Bottom 0.406: R12.2 J3.14
N$11
  Bottom 0.406: R11.2 J3.12
N$12
  Bottom 0.406: J3.10 R10.2
N$13
  Bottom 0.406: J3.8 R9.2 | R9.2 83.57,38.1 83.69,37.97 83.35,37.97 R9.2
N$14
  Bottom 0.406: J3.6 R8.2
N$15
  Bottom 0.406: J3.4 R7.2
N$16
  Bottom 0.406: R6.2 J3.2
N$17
  Top 0.406: LED1.C R4.2
N$18
  Bottom 0.254: U3.SCKO 72.13,28.95 J2.2
N$19
  Bottom 0.254: U3.SDTO 69.97,27.32 70.36,26.92 72.64,26.92 J2.1
N$20
  Top 0.254: U13.2 19.58,37.1 19.94,37.47 C13.2
N$21
  Top 0.254: U6.P$21 14.11,24.88 14.1,24.89 14.1,25.4 14.73,26.04 18.92,26.04 19.56,26.67 20.32,26.67 21.59,27.94 28.19,27.94 28.96,28.7 28.96,31.88 29.84,32.77 R21.2
N$22
  Top 0.254: R21.1 LED3.C
N$23
  Top 0.254: U6.P$19 16.51,25.4 16.64,25.53 19.18,25.53 19.81,26.16 20.57,26.16 21.84,27.43 28.45,27.43 29.46,28.45 29.46,29.97 30.23,30.73 R22.2
N$24
  Top 0.254: R22.1 LED4.A
N$25  (via drill 0.25)
  Top 0.254: U6.P$31 27.03,19.58 27.05,19.56 v27.81,19.56 | R20.2 29.97,28.7 29.97,27.94 v29.72,27.69
  Bottom 0.254: v27.81,19.56 28.7,20.45 28.7,22.73 27.81,23.62 27.81,26.8 28.7,27.69 v29.72,27.69
N$26
  Bottom 0.254: RN1.4 20.76,5.14 20.32,4.7 JP1.8
N$27
  Bottom 0.254: RN1.3 21.4,4.51 20.45,3.56 17.27,3.56 JP1.6
N$28
  Bottom 0.254: RN1.2 22.04,4.38 20.7,3.05 15.24,3.05 JP1.4
N$29
  Bottom 0.254: RN1.1 22.68,4.26 20.95,2.54 13.21,2.54 JP1.2
N$30
  Bottom 0.254: LED8.C R18.2
N$31
  Top 0.254: R30.2 LED5.C
N$32
  Top 0.254: R3.1 51.69,50.93 | 51.69,50.93 R2.1 | U1.P$5 51.52,49.12 51.69,49.12 51.69,50.93
N$33
  Bottom 0.254: R19.2 LED9.C
N$34
  Top 0.254: R31.1 LED6.A
N$35
  Top 0.254: R32.1 LED7.A
N$36
  Top 0.254: R33.2 25.72,40.85 Q2.B 25.89,40.89 26.67,40.89 26.92,40.64 26.92,37.72 26.67,37.47 C13.1
POWER_PG
  Top 0.254: U1.P$8 50.73,47.16 50.63,47.06 R1.1
SPI_CLK  (via drill 0.25)
  Top 0.254: v12.19,57.91 U8.6 17.02,57.91 17.65,57.28 22.99,57.28 23.88,56.39 23.88,44.45 24.51,43.81 29.34,43.81 v30.48,42.67 | v12.19,42.67 U12.6 | U9.6 v12.19,50.29 | TP_CLK.TP 36.32,61.09 11.43,61.09 10.92,60.58 10.92,58.17 v10.67,57.91
  Bottom 0.254: v12.19,42.67 v12.19,50.29 v12.19,57.91 v10.67,57.91 | v30.48,42.67 31.58,41.57 U11.4
SPI_MISO  (via drill 0.25)
  Top 0.254: U8.2 21.84,56.64 v22.73,55.75 23.37,55.12 23.37,44.2 24.26,43.31 28.7,43.31 v30.48,41.53 | v22.1,41.4 U12.2 | U9.2 v22.1,49.02
  Bottom 0.254: v22.1,41.4 v22.1,49.02 22.1,53.98 22.23,54.1 22.23,55.24 v22.73,55.75 27.56,60.58 39.37,60.58 TP_MISO.TP | v30.48,41.53 31.24,40.77 U11.3
SPI_MOSI  (via drill 0.25)
  Top 0.254: 11.43,51.56 11.43,59.18 U8.5 17.02,59.18 17.65,58.55 24.38,58.55 | 11.43,51.56 11.43,43.94 U12.5 | U9.5 11.43,51.56 | 24.38,58.55 24.38,59.69 25.27,60.58 34.29,60.58 TP_MOSI.TP | 24.38,58.55 24.38,44.83 24.64,44.58 v29.72,44.58
  Bottom 0.254: U11.9 32.87,45.57 31.24,43.94 30.35,43.94 v29.72,44.58
SPI_SS1  (via drill 0.25)
  Top 0.254: U8.1 21.46,55.37 21.59,55.24 | 21.59,55.24 22.86,53.98 22.86,43.94 24,42.8 28.19,42.8 30.48,40.51 v30.48,39.24 | v21.46,54.48 21.59,54.61 21.59,55.24
  Bottom 0.254: v30.48,39.24 30.55,39.17 U11.1 | v21.46,54.48 21.59,54.61 21.59,55.63 27.05,61.09 41.4,61.09 TP_SS1.TP
SPI_SS2  (via drill 0.25)
  Top 0.254: U9.1 21.59,47.75 | 21.59,47.75 21.72,47.75 22.35,47.12 22.35,43.69 23.75,42.29 27.94,42.29 29.46,40.77 v29.46,40.01 | v21.21,46.74 21.59,47.12 21.59,47.75
  Bottom 0.254: v29.46,40.01 29.5,39.97 U11.2 | v21.21,46.74 21.21,52.83 20.7,53.34 20.7,55.5 26.8,61.59 43.43,61.59 TP_SS2.TP
SPI_SS3  (via drill 0.25)
  Top 0.254: U12.1 v22.23,40.13
  Bottom 0.254: v22.23,40.13 22.86,40.77 22.86,50.04 24,51.18 42.67,51.18 | 42.67,51.18 42.67,57.4 42.8,57.53 46.99,57.53 TP_SS3.TP | U11.21 42.67,51.18
TEST_LED0
  Bottom 0.254: U11.22 43.48,50.31 LED8.A
TEST_LED1
  Bottom 0.254: U11.23 46.28,47.17 46.35,47.24 46.35,50.38 LED9.A
TEST_SW  (via drill 0.25)
  Top 0.254: R26.1 53.72,14.73 54.05,15.06 SW2.P$2 SW2.P$4 46.32,16.8 45.97,17.14 45.97,23.62 48.64,26.29 48.64,40.89 41.4,48.13 35.31,48.13 v35.31,47.24
  Bottom 0.254: U11.12 35.48,47.42 v35.31,47.24
USB_HPD  (via drill 0.25)
  Top 0.254: U13.4 18.28,33.92 v18.29,33.91 | v13.21,30.99 13.08,30.86 U13.17 | v40.51,39.12 40.51,37.59 39.75,36.83 34.29,36.83 v34.04,37.08
  Bottom 0.254: 13.59,33.91 v18.29,33.91 22.61,33.91 27.81,39.12 28.57,39.12 29.34,38.35 32.77,38.35 v34.04,37.08 | 13.59,33.91 13.08,33.4 13.08,31.11 v13.21,30.99 | U11.24 41.03,46.37 40.51,45.85 v40.51,39.12 | 13.59,33.91 14.03,34.35 C14.1
USB_RX
  Top 0.254: LED6.C 27.47,28.96 21.84,28.96 19.56,31.24 16.64,31.24 16.33,30.93 U13.22
USB_RXD  (via drill 0.25)
  Top 0.254: U13.5 17.63,36.22 17.02,36.83 v16.64,36.83 | v20.32,36.83 22.61,36.83 23.11,36.32 40.77,36.32 v41.15,35.94
  Bottom 0.254: v16.64,36.83 v20.32,36.83 | U11.37 41.08,36.01 v41.15,35.94
USB_TX
  Top 0.254: LED7.C 28.45,32.77 28.45,28.96 27.94,28.45 21.59,28.45 19.3,30.73 16.98,30.73 U13.23
USB_TXD  (via drill 0.25)
  Top 0.254: U13.1 20.23,35.98 20.32,36.07 22.61,36.07 22.86,35.81 40.01,35.81 v40.26,35.56
  Bottom 0.254: U11.38 40.28,36.73 40.26,36.7 v40.26,35.56
USBDM
  Top 0.254: J4.2 12.17,32.75 arc-90 12.43,32.5 U13.16
USBDP
  Top 0.254: J4.3 11.52,31.75 arc-90 11.78,31.5 U13.15
VBAT
  Top 0.406: U1.P$3 U1.P$2 58.42,47.81 | 58.42,47.81 C1.1 58.65,48.26 | 58.42,47.81 64.84,47.81 76.2,36.45 76.2,26.92 73.91,24.64 73.91,17.14 S1.P$1
XTAL0
  Bottom 0.254: U11.29 52.63,42.37 arc-90 53.72,41.27 Q1.2
XTAL1
  Bottom 0.254: U11.28 52.82,43.17 arc90 53.72,44.07 Q1.1

### Text on the board
tNames: ARCANE 2014 | STATUS LEDS | POWER HEARTBEAT / USB TX PAIRING / USB RX BT CONNECT / BT DATA | RESET | TEST | CMPSS
Measures: Mini-USB B opening to be / .5" wide by .4" tall centered / .05" above board surface | Opening for J3 / (3M 2524-5 shrouded right-angle connector) / should be as described / in 3M literature. | Minimum of .2 inches / clearance required beneath / board. With battery charger / installed, battery charger / top surface sits ~.5" above / this board's surface. See / charger.brd for clearance / details | All dimensions in Inches unless otherwise noted.